# EAGLE design Soil Moisture V1.0 (EAGLE 7.5.0)
Soil Moisture and Temperature sensor based on Vegtronix VH400
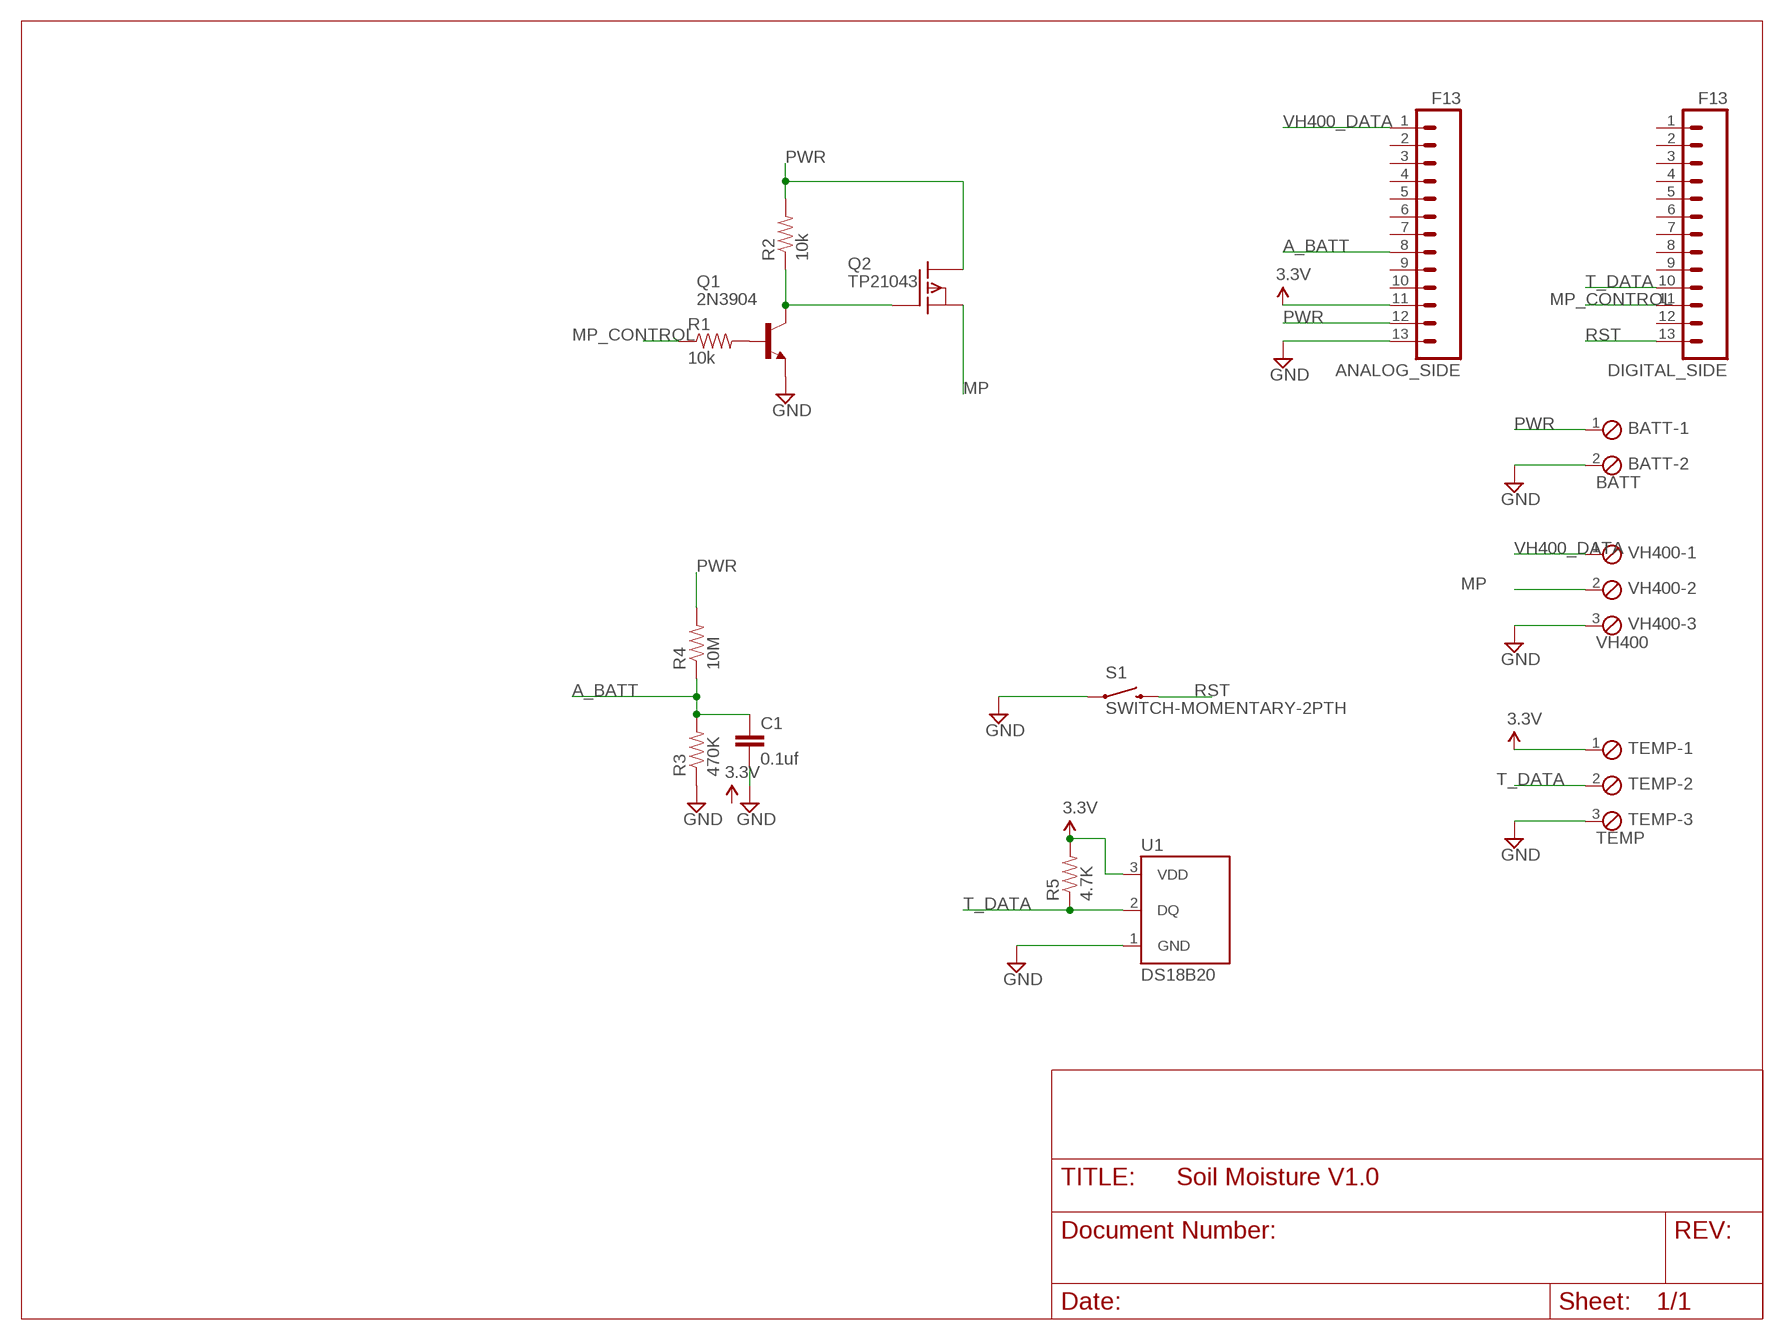
[diagram p0: schematic, sheet 1]

## Parts
ANALOG_SIDE  F13  M13  [1X13]
BATT  BATT  MPT2  [2POL254]
C1  0.1uf  0.1UF-50V-20%(PTH)KIT-EZ  [CAP-PTH-SMALL-KIT]
DIGITAL_SIDE  F13  M13  [1X13]
Q1  2N3904  [TO92]
Q2  TP21043  BSS110  [TO92]
R1  10k  10KOHM-1/4W5%(PTH)HORIZ-KIT  [AXIAL-0.3EZ]
R2  10k  10KOHM-1/4W5%(PTH)HORIZ-KIT  [AXIAL-0.3EZ]
R3  470K  10KOHM-1/4W-1%(PTH)HORIZ  [AXIAL-0.3]
R4  10M  10KOHM-1/4W-1%(PTH)HORIZ  [AXIAL-0.3]
R5  4.7K  10KOHM-1/4W5%(PTH)  [AXIAL-0.3]
S1  SWITCH-MOMENTARY-2PTH  [TACTILE-PTH]
TEMP  TEMP  MPT3  [3POL254]
U1  DS18B20  [TO-92-AMMO]
VH400  VH400  MPT3  [3POL254]

## Nets
3.3V: ANALOG_SIDE.11 R5.P$2 TEMP.1 U1.3(VDD)
A_BATT: ANALOG_SIDE.8 C1.1 R3.P$2 R4.P$1
GND: ANALOG_SIDE.13 BATT.2 C1.2 Q1.3(E) R3.P$1 S1.1 TEMP.3 U1.1(GND) VH400.3
MP: Q2.1(S) VH400.2
MP_CONTROL: DIGITAL_SIDE.11 R1.P$1
N$1: Q1.2(B) R1.P$2
N$3: Q1.1(C) Q2.2(G) R2.P$1
PWR: ANALOG_SIDE.12 BATT.1 Q2.3(D) R2.P$2 R4.P$2
RST: DIGITAL_SIDE.13 S1.3
T_DATA: DIGITAL_SIDE.10 R5.P$1 TEMP.2 U1.2(DQ)
VH400_DATA: ANALOG_SIDE.1 VH400.1
Unconnected: ANALOG_SIDE.2 ANALOG_SIDE.3 ANALOG_SIDE.4 ANALOG_SIDE.5 ANALOG_SIDE.6 ANALOG_SIDE.7 ANALOG_SIDE.9 ANALOG_SIDE.10 DIGITAL_SIDE.1 DIGITAL_SIDE.2 DIGITAL_SIDE.3 DIGITAL_SIDE.4 DIGITAL_SIDE.5 DIGITAL_SIDE.6 DIGITAL_SIDE.7 DIGITAL_SIDE.8 DIGITAL_SIDE.9 DIGITAL_SIDE.12

## Library data of the parts
ANALOG_SIDE DIGITAL_SIDE = SparkFun-Connectors:M13: 13-pin single row .1" header
BATT = con-phoenix-254:MPT2: PHOENIX CONNECTOR; OC_FARNELL: unknown; OC_NEWARK: unknown
C1 = SparkFun-Capacitors:0.1UF-50V-20%(PTH): CAP-08370; PROD_ID: CAP-08370
Q1 = transistor-npn:2N3904: NPN Transistor
Q2 = transistor-fet:BSS110: P-Channel Enhancement MOSFET -50V; -0,17A; 6Ohm
R1 R2 = SparkFun-Resistors:10KOHM-1/4W5%(PTH): RES-09435; PROD_ID: RES-9435
R3 R4 = SparkFun-Resistors:10KOHM-1/4W-1%(PTH): RES-12183; PROD_ID: RES-12183; VALUE: 10k
R5 = SparkFun-Resistors:10KOHM-1/4W5%(PTH): RES-09435; PROD_ID: RES-9435; VALUE: 10k
S1 = SparkFun-Electromechanical:SWITCH-MOMENTARY-2: Various NO switches- pushbuttons, reed, etc; PROD_ID: SWCH-08441
TEMP VH400 = con-phoenix-254:MPT3: PHOENIX CONNECTOR; OC_FARNELL: unknown; OC_NEWARK: unknown
U1 = SparkFun-Sensors:DS18B20: Dallas/Maxim DS18B20 1-wire temperature sensor Datasheet: http://datasheets.maximintegrated.com/en/ds/DS18B20.pdf temp thermometer 1-wire one-wire one wire; STORE_ID: SEN-00245

## Net classes
0 default: clearance 0.205 mm

## Board
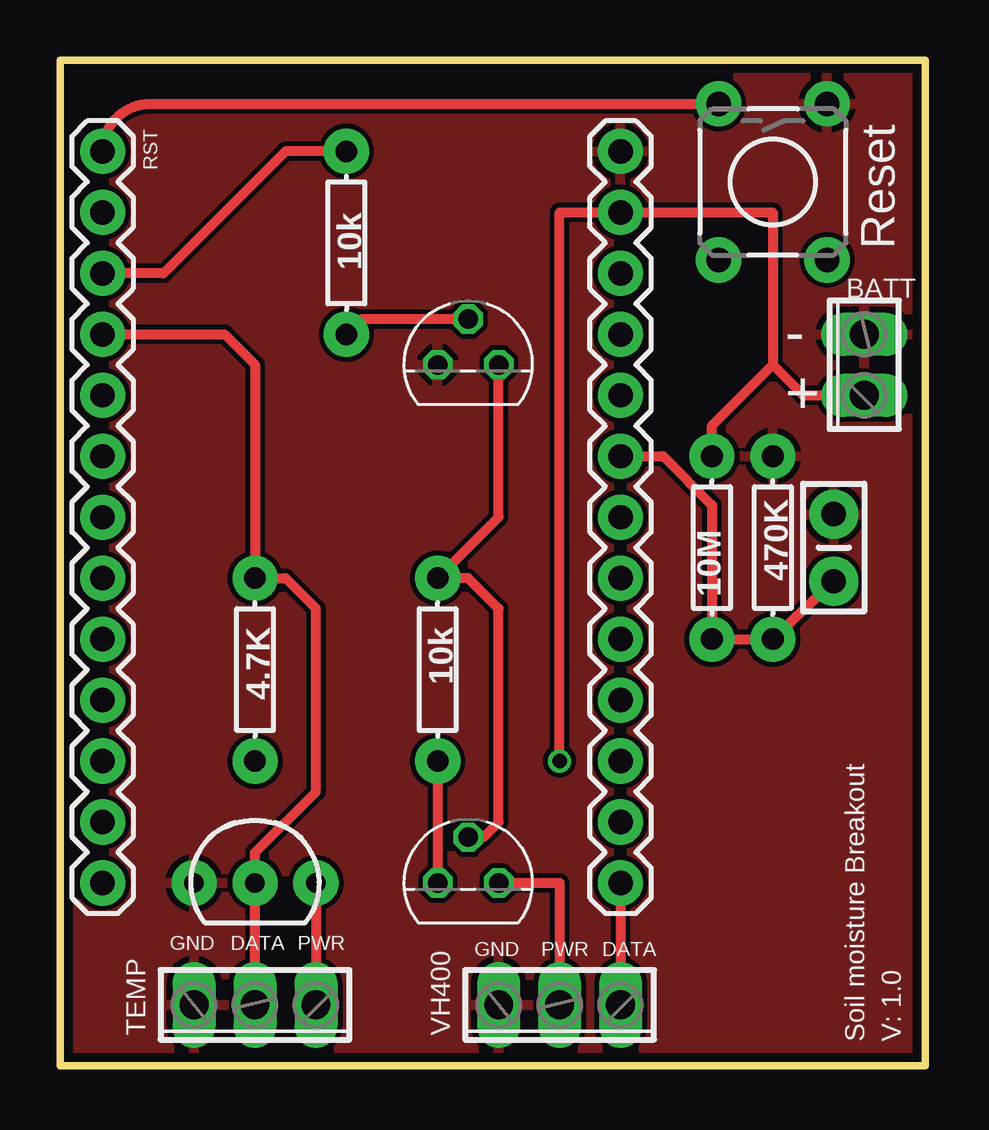
[diagram p1: board, top side]
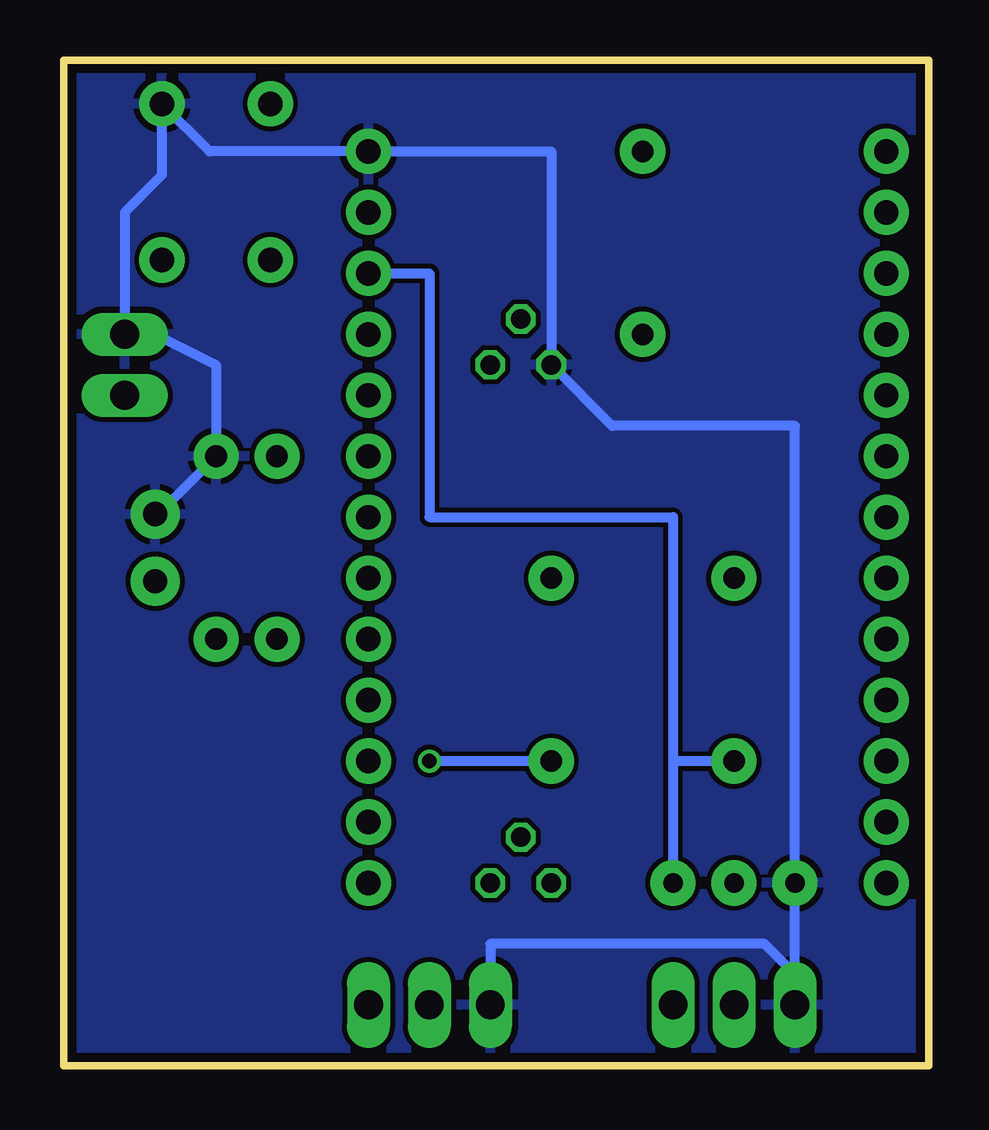
[diagram p2: board, bottom side, seen from below]

Size 36.07 x 41.91 mm. Coordinates in mm from the lower left corner, seen from the top.
Outline: 0,41.9 0,0
Outline: 0,0 36.07,0 36.07,41.91 0,41.91 0,0
Copper layers (1*16): Top 0.0356mm / dielectric 1.5011mm / Bottom 0.0356mm
Design rules "Soil Moisture": minimum track width 6mil, minimum drill 13mil, track to track 0.205mm, track to pad 0.205mm, pad to pad 0.205mm, via to via 0.205mm, smd to smd 6mil, copper to edge 15mil, drill to drill 6mil, minimum pad ring 7mil, minimum via ring 7mil, stop-mask expansion 2.5mil, vias tented up to drill 0mil, thermal gap 10mil

### Footprints (pad centres in the part's own frame; a part is rotated, then mirrored left to right if it is on the bottom)
1X13 = drill 1.016 pad 1.88: 1 0,0; 2 2.54,0; 3 5.08,0; 4 7.62,0; 5 10.16,0; 6 12.7,0; 7 15.24,0; 8 17.78,0; 9 20.32,0; 10 22.86,0; 11 25.4,0; 12 27.94,0; 13 30.48,0
2POL254 = drill 1.2 long: 1 -1.27,0; 2 1.27,0
CAP-PTH-SMALL-KIT = drill 1.016 pad 2.032: 1 -1.397,0; 2 1.397,0
TO92 = drill 0.813 octagon: 1 1.27,0; 2 0,1.905; 3 -1.27,0
AXIAL-0.3EZ = drill 0.9 pad 1.88: P$1 -3.81,0; P$2 3.81,0
AXIAL-0.3 = drill 0.9 pad 1.88: P$1 -3.81,0; P$2 3.81,0
TACTILE-PTH = drill 1.016 pad 1.88: 1 -3.251,2.261; 2 3.251,2.261; 3 -3.251,-2.261; 4 3.251,-2.261
3POL254 = drill 1.2 long: 1 -2.54,0; 2 0,0; 3 2.54,0
TO-92-AMMO = drill 0.813 pad 1.88: 1 -2.54,0; 2 0,0; 3 2.54,0

### Placement (x,y rotation side)
ANALOG_SIDE  23.37,7.62 90 top
BATT  33.53,29.21 90 top
C1  32.26,21.59 90 top
DIGITAL_SIDE  1.78,7.62 90 top
Q1  17.02,29.21 0 top
Q2  17.02,7.62 0 top
R1  11.94,34.29 270 top
R2  15.75,16.51 270 top
R3  29.72,21.59 270 top
R4  27.18,21.59 90 top
R5  8.13,16.51 270 top
S1  29.72,36.83 270 top
TEMP  8.13,2.54 180 top
U1  8.13,7.62 0 top
VH400  20.83,2.54 180 top

### Tracks (layer width: path | path; a pad name or v marks a point on that pad's centre or on a via)
3.3V
  Top 0.406: U1.3 TEMP.1
  Bottom 0.406: ANALOG_SIDE.11 20.83,33.02 20.83,22.86 10.67,22.86 10.67,12.7 | 10.67,12.7 U1.3 | R5.P$2 10.67,12.7
A_BATT
  Top 0.406: C1.1 R3.P$2 R4.P$1 27.18,23.37 25.15,25.4 ANALOG_SIDE.8
GND
  Bottom 0.406: VH400.3 18.29,5.08 6.86,5.08 5.59,3.81 TEMP.3 U1.1 5.59,26.67 13.21,26.67 Q1.3 15.75,38.1 ANALOG_SIDE.13 30,38.1 S1.1 31.98,37.11 33.53,35.56 BATT.2 32.26,30.48 29.72,29.21 R3.P$1 32.13,22.99 C1.2
  pour Bottom: 0,41.91 36.07,41.91 36.07,0 0,0
  pour Top: 0,41.91 36.07,41.91 36.07,0 0,0
MP
  Top 0.406: Q2.1 20.83,7.62 VH400.2
MP_CONTROL
  Top 0.406: R1.P$1 9.4,38.1 4.32,33.02 DIGITAL_SIDE.11
N$1
  Top 0.406: Q1.2 12.57,31.12 R1.P$2
N$3
  Top 0.406: Q2.2 17.65,9.52 18.29,10.16 18.29,19.05 17.02,20.32 R2.P$1 18.29,22.86 Q1.1
PWR  (via drill 0.6)
  Top 0.406: v20.83,12.7 20.83,35.56 ANALOG_SIDE.12 29.72,35.56 29.72,29.21 | 29.72,29.21 30.99,27.94 BATT.1 | R4.P$2 27.18,26.67 29.72,29.21 | R2.P$2 Q2.3
  Bottom 0.406: R2.P$2 v20.83,12.7
RST
  Top 0.406: DIGITAL_SIDE.13 arc-90 3.76,40.08 S1.3
T_DATA
  Top 0.406: TEMP.2 U1.2 8.13,8.89 10.67,11.43 10.67,19.05 9.4,20.32 R5.P$1 8.13,29.21 6.86,30.48 DIGITAL_SIDE.10
VH400_DATA
  Top 0.406: ANALOG_SIDE.1 VH400.1

### Text on the board
tPlace: RST | Reset | - | + | GND | DATA | PWR | GND | PWR | DATA | Soil moisture Breakout | V: 1.0